# Altium schematic sheet LazerSensors.SchDoc
size A3; SheetNumber: 2; SheetTotal: 6
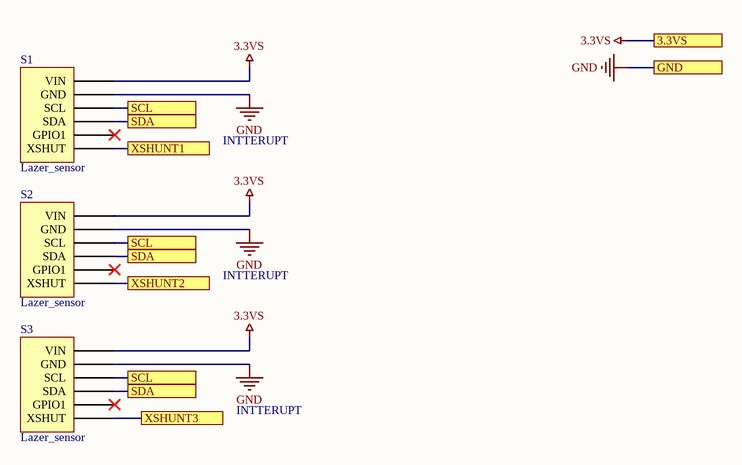
[diagram p0: LazerSensors.SchDoc]

## Parts
S1  Lazer_sensor  [Lazer_Sensor]
S2  Lazer_sensor  [Lazer_Sensor]
S3  Lazer_sensor  [Lazer_Sensor]

## Ports
3.3VS, GND, SCL, SDA, XSHUNT1, XSHUNT2, XSHUNT3

## Nets
3.3VS: S1.1(VIN) S2.1(VIN) S3.1(VIN) ; port 3.3VS
GND: S1.2(GND) S2.2(GND) S3.2(GND) ; port GND
SCL: S1.3(SCL) S2.3(SCL) S3.3(SCL) ; port SCL
SDA: S1.4(SDA) S2.4(SDA) S3.4(SDA) ; port SDA
XSHUNT1: S1.6(XSHUT) ; port XSHUNT1
XSHUNT2: S2.6(XSHUT) ; port XSHUNT2
XSHUNT3: S3.6(XSHUT) ; port XSHUNT3

Not connected (* = marked no-connect by the designer): S1 5(GPIO1)*; S2 5(GPIO1)*; S3 5(GPIO1)*

## Notes on the sheet
- INTTERUPT

## Library data of the parts
S1-S3 = Lazer_sensor: VL53L0X (ToF-F) 940nm GY-VL53L0XV2 I2C